# Altium project STK200_BLUETOOTH.PRJPCB
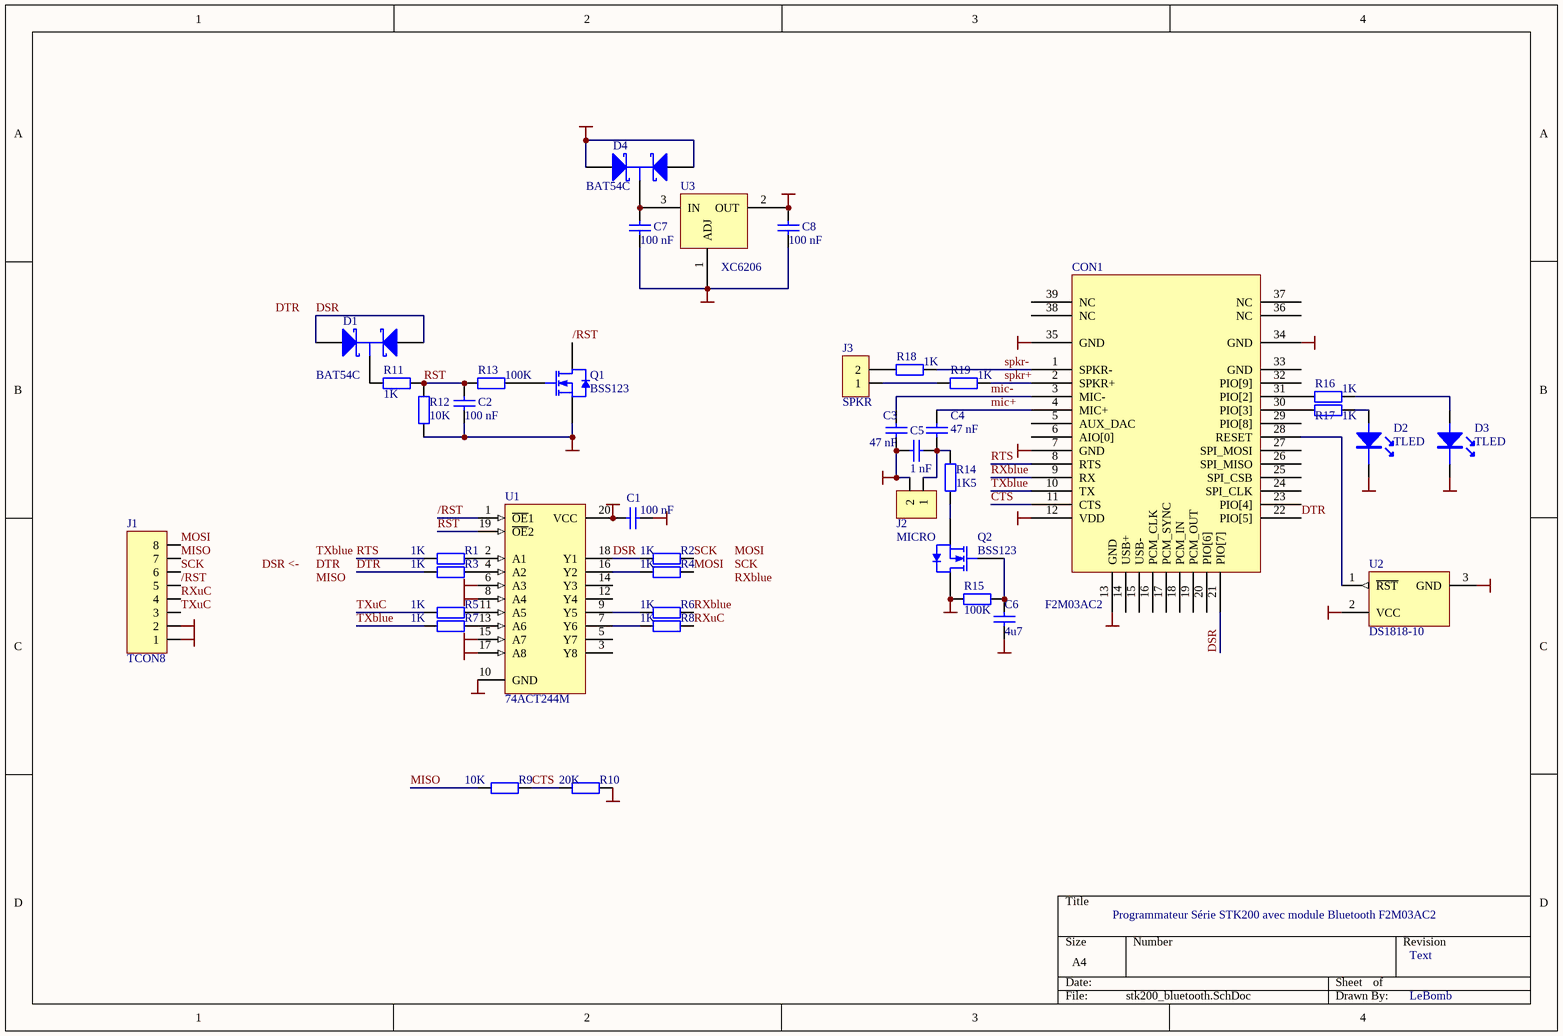
[diagram p0: stk200_bluetooth.SchDoc]
1 sheet, 40 parts. Net scope: global (net labels, ports and power ports of the same name join across sheets).
Board file: stk200_bluetooth.PcbDoc

## Sheet stk200_bluetooth.SchDoc
size A4

### Parts
C1  value 100 nF  [0805]  (hidden comment: Cap)
C2  value 100 nF  [0805]  (hidden comment: Cap)
C3  value 47 nF  [0805]  (hidden comment: Cap)
C4  value 47 nF  [0805]  (hidden comment: Cap)
C5  value 1 nF  [0805]  (hidden comment: Cap)
C6  value 4u7  [0805]  (hidden comment: Cap)
C7  value 100 nF  [0805]  (hidden comment: Cap)
C8  value 100 nF  [0805]  (hidden comment: Cap)
CON1  F2M03AC2  [F2M03AC2_conn]
D1  BAT54C  [SOT23]
D2  TLED  [0805]
D3  TLED  [0805]
D4  BAT54C  [SOT23]
J1  TCON8  [TSIP8]
J2  MICRO  [CON2]
J3  SPKR  [CON2]
Q1  BSS123  [SOT23]
Q2  BSS123  [SOT23]
R1  value 1K  [0805]  (hidden comment: Res2)
R2  value 1K  [0805]  (hidden comment: Res2)
R3  value 1K  [0805]  (hidden comment: Res2)
R4  value 1K  [0805]  (hidden comment: Res2)
R5  value 1K  [0805]  (hidden comment: Res2)
R6  value 1K  [0805]  (hidden comment: Res2)
R7  value 1K  [0805]  (hidden comment: Res2)
R8  value 1K  [0805]  (hidden comment: Res2)
R9  value 10K  [0805]  (hidden comment: Res2)
R10  value 20K  [0805]  (hidden comment: Res2)
R11  value 1K  [0805]  (hidden comment: Res2)
R12  value 10K  [0805]  (hidden comment: Res2)
R13  value 100K  [0805]  (hidden comment: Res2)
R14  value 1K5  [0805]  (hidden comment: Res2)
R15  value 100K  [0805]  (hidden comment: Res2)
R16  value 1K  [0805]  (hidden comment: Res2)
R17  value 1K  [0805]  (hidden comment: Res2)
R18  value 1K  [0805]  (hidden comment: Res2)
R19  value 1K  [0805]  (hidden comment: Res2)
U1  74ACT244M  [SO20]
U2  DS1818-10  [SOT-23]
U3  XC6206  [sot-23]

### Nets
3V3: C1.1 C8.2 CON1.12(VDD) Q2.3(D) R15.2 U1.20(VCC) U2.2(VCC) U3.2(OUT)
5V: D4.1(A1) D4.2(A2) J1.1
GND: C1.2 C2.1 C3.1 C5.2 C6.1 C7.1 C8.1 CON1.7(GND) CON1.13(GND) CON1.34(GND) CON1.35(GND) D2.2 D3.2 J1.2 J2.2 Q1.2(S) R10.2 R12.1 U1.6(A3) U1.8(A4) U1.10(GND) U1.15(A7) U1.17(A8) U2.3(GND) U3.1(ADJ)
/RST: J1.5 Q1.3(D) U1.1(~{OE}1)
CTS: CON1.11(CTS) R9.2 R10.1
DSR: CON1.21(PIO[7]) D1.1(A1) D1.2(A2) R2.1 U1.18(Y1)
DTR: CON1.22(PIO[5]) R3.1
mic+: C4.2 CON1.4(MIC+)
mic-: C3.2 CON1.3(MIC-)
MISO: J1.7 R9.1
MOSI: J1.8 R4.2
RST: C2.2 R11.2 R12.2 R13.1 U1.19(~{OE}2)
RTS: CON1.8(RTS) R1.1
RXblue: CON1.9(RX) R6.2
RXuC: J1.4 R8.2
SCK: J1.6 R2.2
spkr+: CON1.2(SPKR+) R19.1
spkr-: CON1.1(SPKR-) R18.1
TXblue: CON1.10(TX) R7.1
TXuC: J1.3 R5.1
NetC4_1: C4.1 C5.1 J2.1 R14.2
NetC6_2: C6.2 Q2.1(G) R15.1
NetC7_2: C7.2 D4.3(K) U3.3(IN)
NetCON1_28: CON1.28(RESET) U2.1(~{RST})
NetCON1_30: CON1.30(PIO[3]) R17.1
NetCON1_31: CON1.31(PIO[2]) R16.1
NetD1_3: D1.3(K) R11.1
NetD2_1: D2.1 R17.2
NetD3_1: D3.1 R16.2
NetJ3_1: J3.1 R19.2
NetJ3_2: J3.2 R18.2
NetQ1_1: Q1.1(G) R13.2
NetQ2_2: Q2.2(S) R14.1
NetR1_2: R1.2 U1.2(A1)
NetR3_2: R3.2 U1.4(A2)
NetR4_1: R4.1 U1.16(Y2)
NetR5_2: R5.2 U1.11(A5)
NetR6_1: R6.1 U1.9(Y5)
NetR7_2: R7.2 U1.13(A6)
NetR8_1: R8.1 U1.7(Y6)

Not connected (* = marked no-connect by the designer): CON1 5(AUX_DAC) 6(AIO[0]) 14(USB+) 15(USB-) 16(PCM_CLK) 17(PCM_SYNC) 18(PCM_IN) 19(PCM_OUT) 20(PIO[6]) 23(PIO[4]) 24(SPI_CLK) 25(SPI_CSB) 26(SPI_MISO) 27(SPI_MOSI) 29(PIO[8]) 32(PIO[9]) 33(GND) 36(NC) 37(NC) 38(NC) 39(NC); U1 3(Y8) 5(Y7) 12(Y4) 14(Y3)

### Notes on the sheet
- Programmateur Série STK200 avec module Bluetooth F2M03AC2
- Text
- LeBomb
- Labels drawn without touching a wire or pin: DSR <-, DTR, MISO, MOSI, RXblue, SCK, TXblue

### Library data of the parts
C1-C8 = Cap: Capacitor; Published: 8-Jun-2000; Revision: July-2002: Re-released for DXP Platform.; Publisher: Altium Limited
D1 D4 = BAT54C: Schottky Barrier Double Diode; Published: 17-Sep-2003; DatasheetDocument: 4-Mar-2002; PackageDocument: May-1999; PackageReference: SOT23; Publisher: Altium Limited
J2 J3 = CON2
Q1 Q2 = BSS123: N-channel Enhancement Mode Vertical D-MOSFET; Published: 17-Sep-2003; DatasheetDocument: Apr-1995; PackageDocument: May-1999; PackageReference: SOT23; Publisher: Altium Limited
R1-R19 = Res2: Resistor; Published: 8-Jun-2000; Revision: July-2002: Re-released for DXP Platform.; Publisher: Altium Limited
U1 = 74ACT244M: Octal Bus Buffer with 3 State Outputs (Non Inverted); Published: 8-Jun-2000; LatestRevisionDate: 6-Jun-2005; LatestRevisionNote: Stylized 3D Model Added.; DatasheetDocument: Feb-1999; PackageDocument: Jul-2001; PackageReference: SO20; Publisher: Altium Limited; Code_JEDEC: MS-013-AC; Code_IPC: SO20W; ComponentLink1Description: Manufacturer Link; ComponentLink1URL: http://www.st.com/; ComponentLink2Description: Datasheet; ComponentLink2URL: http://www.st.com/stonline/products/literature/ds/4825/74act244.pdf
U2 = DS1818-10: 3.3V EconoReset with Pushbutton; Published: 13-Oct-2000; LatestRevisionDate: 17-Jul-2002; LatestRevisionNote: Re-released for DXP Platform.; DatasheetDocument: 7-May-1998; PackageDocument: Feb-1999; PackageReference: TO-92; Publisher: Altium Limited; ComponentLink1Description: Manufacturer Link; ComponentLink1URL: http://www.maxim-ic.com/; ComponentLink2Description: Datasheet; ComponentLink2URL: http://pdfserv.maxim-ic.com/en/ds/DS1818.pdf
U3 = LM317